# EAGLE design RealCam (EAGLE 9.3.1)
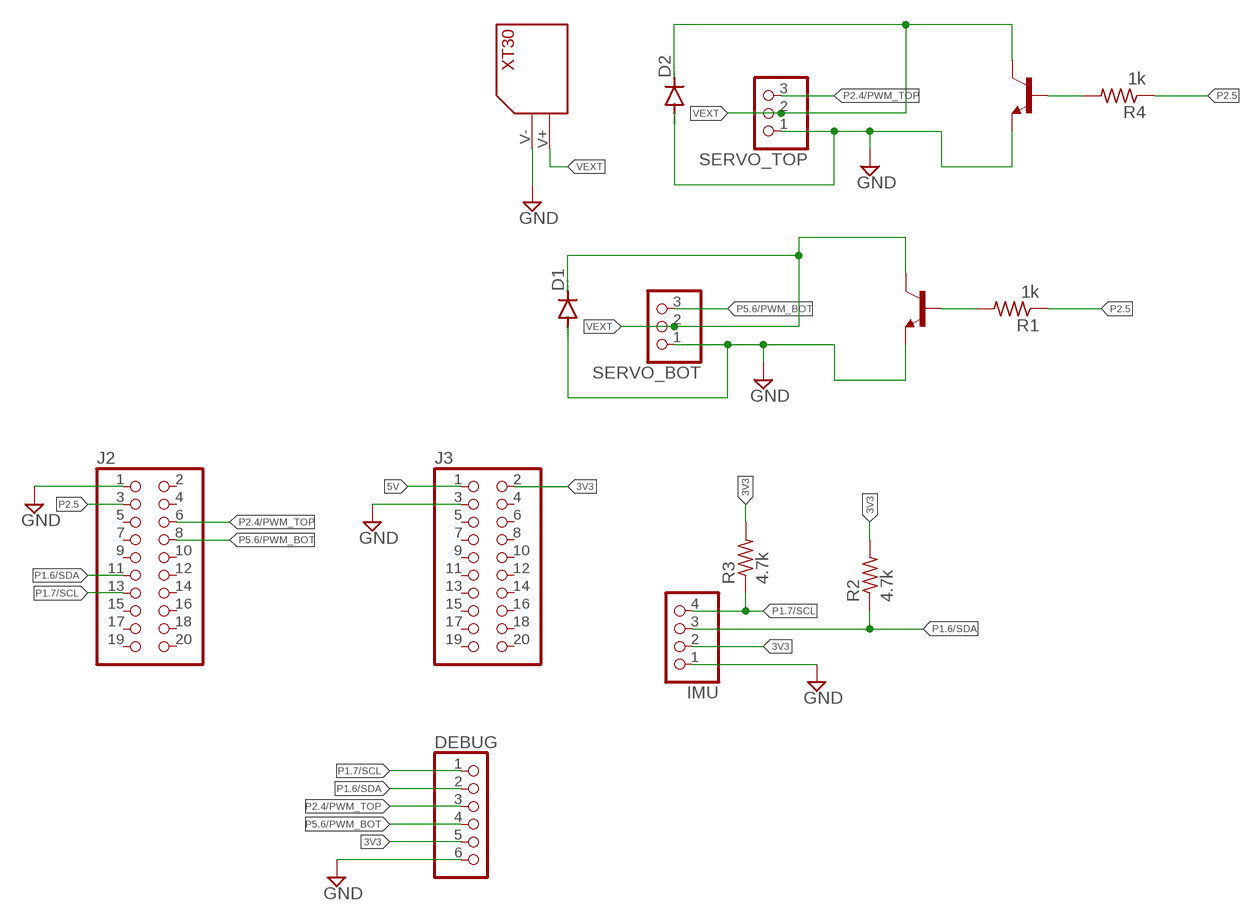
[diagram p0: schematic, sheet 1]

## Parts
D1  1N4933  [DO41-10]
D2  1N4933  [DO41-10]
DEBUG  PINHD-1X6  [1X06]
IMU  PINHD-1X4  [1X04]
J2  PINHD-2X10  [2X10]
J3  PINHD-2X10  [2X10]
NPN_BC1  2N3565  [TO92]
NPN_BC337  2N3565  [TO92]
R1  1k  R-US_R0805  [R0805]
R2  4.7k  R-US_R0805  [R0805]
R3  4.7k  R-US_R0805  [R0805]
R4  1k  R-US_R0805  [R0805]
SERVO_BOT  PINHD-1X3  [1X03]
SERVO_TOP  PINHD-1X3  [1X03]
U$1  XT30_RIGHT_ANGLE  [XT30_RIGHT_ANGLE]

## Nets
3V3: DEBUG.5 IMU.2 J3.2 R2.2 R3.2
5V: J3.1
GND: D1.A D2.A DEBUG.6 IMU.1 J2.1 J3.3 NPN_BC1.3(E) NPN_BC337.3(E) SERVO_BOT.1 SERVO_TOP.1 U$1.V-
N$1: NPN_BC337.2(B) R1.2
N$2: NPN_BC1.2(B) R4.2
P1.6/SDA [I2C]: DEBUG.2 IMU.3 J2.11 R2.1
P1.7/SCL [I2C]: DEBUG.1 IMU.4 J2.13 R3.1
P2.4/PWM_TOP: DEBUG.3 J2.6 SERVO_TOP.3
P2.5: J2.3 R1.1 R4.1
P5.6/PWM_BOT: DEBUG.4 J2.8 SERVO_BOT.3
VEXT: D1.C D2.C NPN_BC1.1(C) NPN_BC337.1(C) SERVO_BOT.2 SERVO_TOP.2 U$1.V+
Unconnected: J2.2 J2.4 J2.5 J2.7 J2.9 J2.10 J2.12 J2.14 J2.15 J2.16 J2.17 J2.18 J2.19 J2.20 J3.4 J3.5 J3.6 J3.7 J3.8 J3.9 J3.10 J3.11 J3.12 J3.13 J3.14 J3.15 J3.16 J3.17 J3.18 J3.19 J3.20

## Library data of the parts
D1 D2 = diode:1N4933: DIODE fast recovery rectifier, 1A
DEBUG = pinhead:PINHD-1X6: PIN HEADER
IMU = pinhead:PINHD-1X4: PIN HEADER
J2 J3 = pinhead:PINHD-2X10: PIN HEADER
NPN_BC1 NPN_BC337 = transistor:2N3565: NPN TRANSISTOR
R1-R4 = rcl:R-US_: RESISTOR, American symbol; SPICEPREFIX: R
SERVO_BOT SERVO_TOP = pinhead:PINHD-1X3: PIN HEADER
U$1 = RMC:XT30_RIGHT_ANGLE: XT30 PW Right Angle Connector Source of model dimensions: https://www.aliexpress.com/item/32691770172.html

## Net classes
1 I2C: width 0.305 mm

## Board
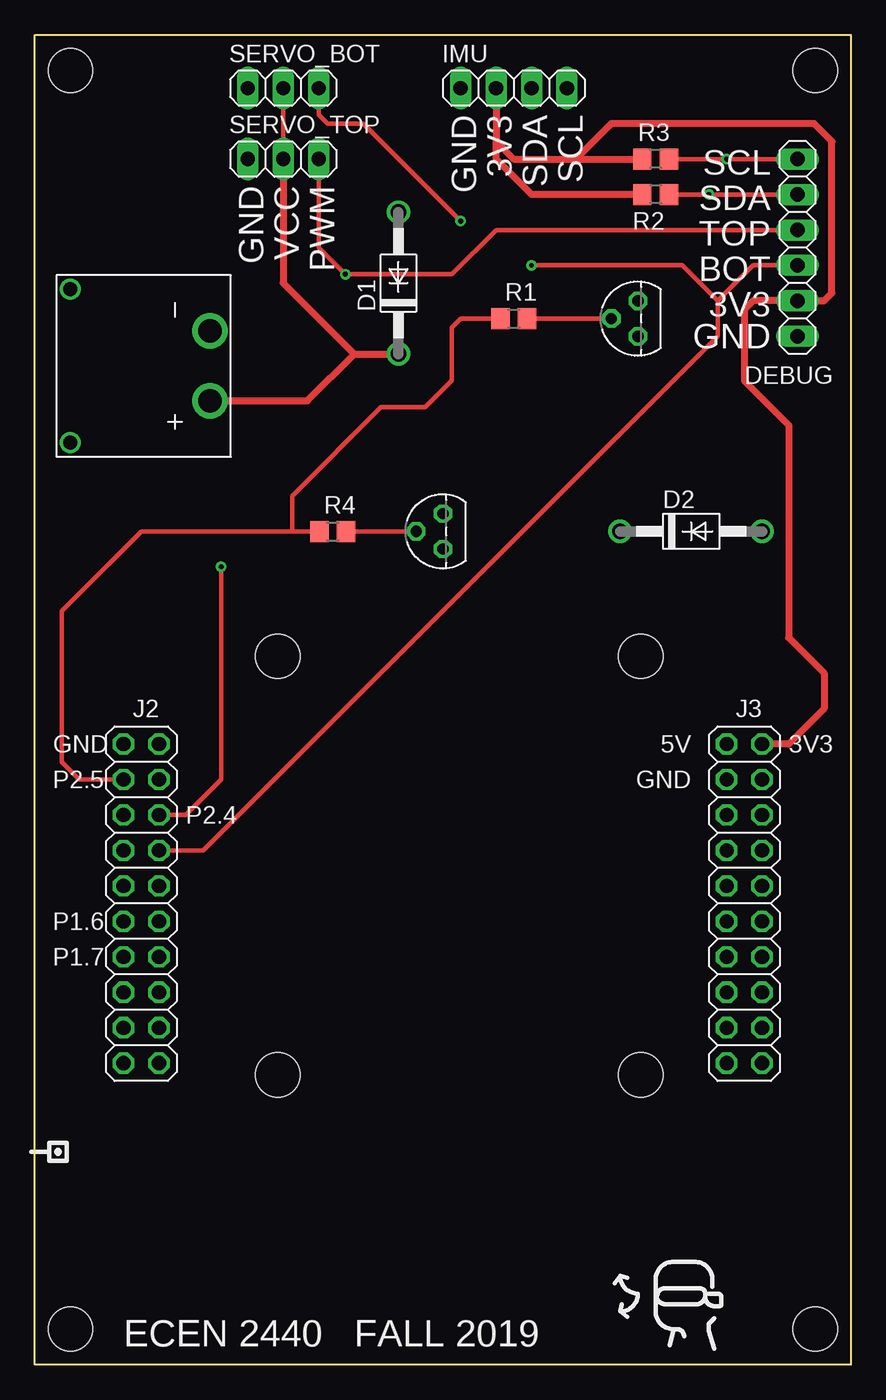
[diagram p1: board, top side]
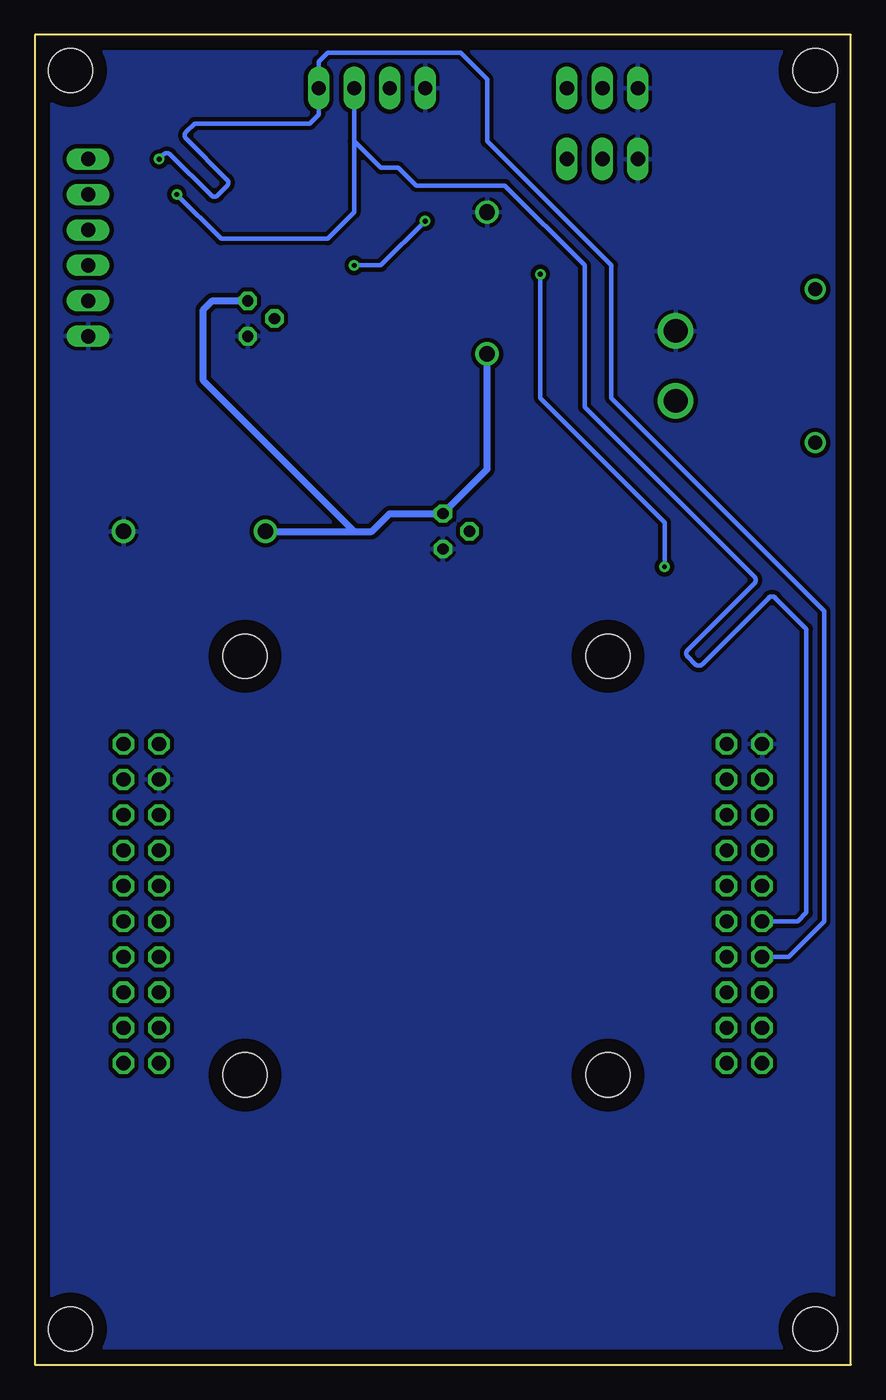
[diagram p2: board, bottom side, seen from below]

Size 58.42 x 95.25 mm. Coordinates in mm from the lower left corner, seen from the top.
Outline: 0,0 0,95.25 58.42,95.25 58.42,0 0,0
Copper layers (1*16): Top 0.035mm / dielectric 1.5mm / Bottom 0.035mm
Design rules "default": minimum track width 6mil, minimum drill 0.35mm, track to track 6mil, track to pad 6mil, pad to pad 6mil, via to via 6mil, smd to smd 6mil, copper to edge 40mil, drill to drill 6mil, minimum pad ring 10mil, minimum via ring 8mil, stop-mask expansion 4mil, vias tented up to drill 0mil, thermal gap 10mil

### Footprints (pad centres in the part's own frame; a part is rotated, then mirrored left to right if it is on the bottom)
DO41-10 = drill 1.118: A 5.08,0; C -5.08,0
1X06 = drill 1.016 long: 1 -6.35,0; 2 -3.81,0; 3 -1.27,0; 4 1.27,0; 5 3.81,0; 6 6.35,0
1X04 = drill 1.016 long: 1 -3.81,0; 2 -1.27,0; 3 1.27,0; 4 3.81,0
2X10 = drill 1.016 octagon: 1 -11.43,-1.27; 2 -11.43,1.27; 3 -8.89,-1.27; 4 -8.89,1.27; 5 -6.35,-1.27; 6 -6.35,1.27; 7 -3.81,-1.27; 8 -3.81,1.27; 9 -1.27,-1.27; 10 -1.27,1.27; 11 1.27,-1.27; 12 1.27,1.27; 13 3.81,-1.27; 14 3.81,1.27; 15 6.35,-1.27; 16 6.35,1.27; 17 8.89,-1.27; 18 8.89,1.27; 19 11.43,-1.27; 20 11.43,1.27
TO92 = drill 0.813 octagon: 1 1.27,0; 2 0,1.905; 3 -1.27,0
R0805 = smd 1.3 x 1.5: 1 -0.95,0; 2 0.95,0
1X03 = drill 1.016 long: 1 -2.54,0; 2 0,0; 3 2.54,0
XT30_RIGHT_ANGLE = drill 1: P$1 0,0; P$2 11,0 | drill 1.7: V+ 3,-10; V- 8,-10
MOUNTHOLE_125MIL = hole 3.175: 0,0

### Placement (x,y rotation side)
D1  26.04,77.47 90 top
D2  46.99,59.69 0 top
DEBUG  54.61,80.01 270 top
IMU  34.29,91.44 0 top
J2  7.62,33.02 270 top
J3  50.8,33.02 270 top
NPN_BC1  29.21,59.69 90 top
NPN_BC337  43.18,74.93 90 top
R1  34.29,74.93 0 top
R2  44.45,83.82 180 top
R3  44.45,86.36 180 top
R4  21.33,59.67 0 top
SERVO_BOT  17.78,91.44 0 top
SERVO_TOP  17.78,86.36 0 top
U$1  2.54,66.04 90 top
U$2  MOUNTHOLE_125MIL  [MOUNTHOLE_125MIL]  2.54,2.54 0 top
U$3  MOUNTHOLE_125MIL  [MOUNTHOLE_125MIL]  55.88,2.54 0 top
U$4  MOUNTHOLE_125MIL  [MOUNTHOLE_125MIL]  2.54,92.71 0 top
U$5  MOUNTHOLE_125MIL  [MOUNTHOLE_125MIL]  55.88,92.71 0 top
U$6  MOUNTHOLE_125MIL  [MOUNTHOLE_125MIL]  17.38,50.75 0 top
U$7  MOUNTHOLE_125MIL  [MOUNTHOLE_125MIL]  43.38,50.75 0 top
U$8  MOUNTHOLE_125MIL  [MOUNTHOLE_125MIL]  17.38,20.75 0 top
U$9  MOUNTHOLE_125MIL  [MOUNTHOLE_125MIL]  43.38,20.75 0 top

### Tracks (layer width: path | path; a pad name or v marks a point on that pad's centre or on a via)
3V3
  Top 0.508: IMU.2 33.02,87.63 | 33.02,87.63 34.29,86.36 38.73,86.36 | 38.73,86.36 R3.2 | R2.2 35.56,83.82 33.02,86.36 33.02,87.63 | 38.73,86.36 41.27,88.9 55.8,88.9 57.07,87.63 57.07,76.76 56.51,76.2 DEBUG.5 51.43,76.2 50.8,75.56 50.8,70.48 53.97,67.31 53.97,52.07 56.51,49.53 56.51,46.99 53.97,44.45 J3.2
GND
  pour Bottom (isolate 0.305): 0,95.25 58.42,95.25 58.42,0 0,0
N$1
  Top 0.305: R1.2 NPN_BC337.2
N$2
  Top 0.305: NPN_BC1.2 27.29,59.67 R4.2
P1.6/SDA  (via drill 0.35)
  Top 0.305: R2.1 v48.26,83.82 DEBUG.2
  Bottom 0.305: IMU.3 35.56,87.63 | 35.56,87.63 35.56,82.55 37.46,80.65 45.08,80.65 v48.26,83.82 | J2.11 3.81,31.75 3.18,32.38 3.18,52.7 5.4,54.93 arc-90 5.88,54.93 10.65,50.16 arc90 11.13,50.16 11.68,50.71 arc90 11.68,51.19 6.91,55.96 arc-90 6.91,56.44 19.05,68.58 19.05,78.74 24.77,84.45 31.11,84.45 32.38,85.73 33.65,85.73 35.56,87.63
P1.7/SCL  (via drill 0.35)
  Top 0.305: DEBUG.1 v49.53,86.36 R3.1
  Bottom 0.305: v49.53,86.36 49.21,86.68 arc90 48.73,86.68 45.81,83.76 arc-90 45.33,83.76 44.67,84.41 arc-90 44.67,84.9 47.59,87.81 arc90 47.59,88.3 46.99,88.9 38.73,88.9 38.1,89.54 38.1,90.81 IMU.4 38.1,93.34 37.46,93.98 27.94,93.98 26.04,92.08 26.04,87.63 17.14,78.74 17.14,69.22 1.9,53.97 1.9,31.75 4.45,29.21 J2.13
P2.4/PWM_TOP  (via drill 0.35)
  Top 0.305: DEBUG.3 33.02,81.28 29.84,78.11 v22.23,78.11 20.32,80.01 SERVO_TOP.3 | J2.6 10.79,39.37 13.34,41.91 v13.34,57.15
  Bottom 0.305: v13.34,57.15 13.34,60.32 22.23,69.22 v22.23,78.11
P2.5
  Top 0.305: R4.1 18.41,59.67 | 18.41,59.67 7.61,59.67 1.9,53.97 1.9,43.18 3.18,41.91 J2.3 | R1.1 30.48,74.93 29.84,74.3 29.84,70.48 27.94,68.58 24.77,68.58 18.41,62.23 18.41,59.67
P5.6/PWM_BOT  (via drill 0.35)
  Top 0.305: J2.8 12.07,36.83 48.89,73.66 48.89,76.2 | 48.89,76.2 51.43,78.74 DEBUG.4 | 48.89,76.2 46.35,78.74 v35.56,78.74 | v30.48,81.92 23.5,88.9 20.96,88.9 20.32,89.54 SERVO_BOT.3
  Bottom 0.305: v35.56,78.74 33.65,78.74 v30.48,81.92
VEXT
  Top 0.305: SERVO_TOP.2 SERVO_BOT.2
  Top 0.508: U$1.V+ 19.51,69.04 22.86,72.39 | 22.86,72.39 D1.C | SERVO_TOP.2 17.78,77.47 22.86,72.39
  Bottom 0.508: D2.C 35.56,59.69 | 35.56,59.69 34.29,59.69 33.02,60.96 NPN_BC1.1 26.04,64.14 D1.C | 35.56,59.69 46.35,70.48 46.35,75.56 45.72,76.2 NPN_BC337.1

### Text on the board
tPlace: GND | 3V3 | SDA | SCL | SCL | GND | VCC | PWM | SDA | TOP | BOT | 3V3 | GND | DEBUG | 5V | GND | 3V3 | GND | P2.5 | P2.4 | P1.6 | P1.7 | ECEN 2440 | FALL 2019